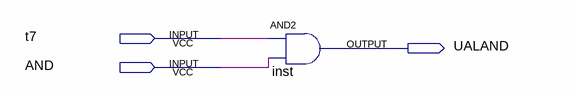
[diagram p0: schematic sheet]
// Quartus schematic UALAND.bdf as structural Verilog: 1 symbols, 3 pins
module UALAND (
  input  t7,
  input  AND,
  output UALAND
);

  and inst (UALAND, t7, AND);
endmodule
